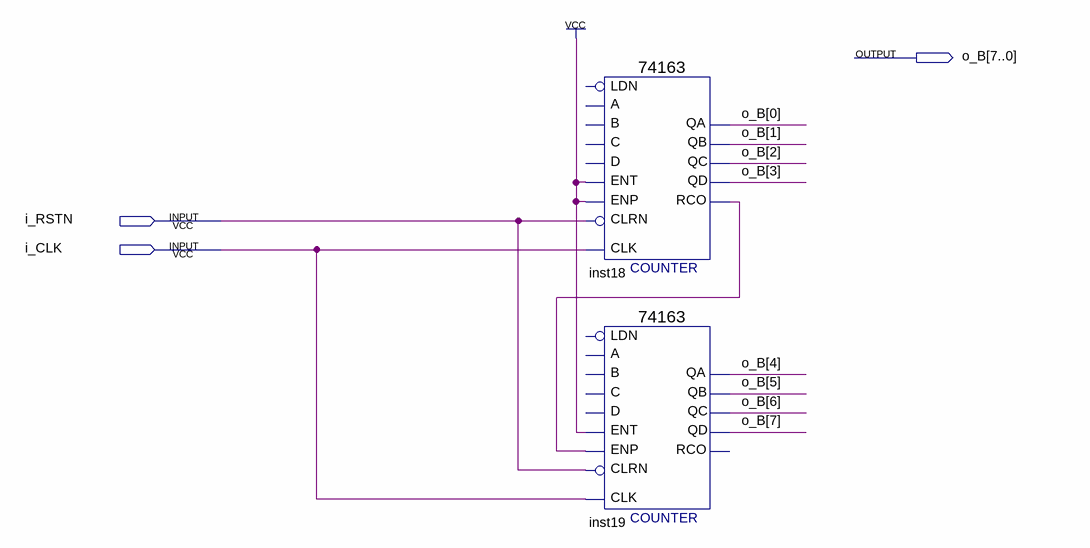
[diagram p0: schematic sheet]
// Quartus schematic counter_99.bdf as structural Verilog: 2 symbols, 3 pins
module counter_99 (
  input  i_RSTN,
  input  i_CLK,
  output [7:0] o_B
);

  wire inst18_rco;

  \74163  inst18 (
    .ENT(1'b1), .CLRN(i_RSTN), .CLK(i_CLK), .ENP(1'b1), .QA(o_B[0]), .QB(o_B[1]), .QC(o_B[2]), .QD(o_B[3]),
    .RCO(inst18_rco));  // open: C, B, A, D, LDN
  \74163  inst19 (
    .ENT(1'b1), .CLRN(i_RSTN), .CLK(i_CLK), .ENP(inst18_rco), .QA(o_B[4]), .QB(o_B[5]), .QC(o_B[6]),
    .QD(o_B[7]));  // open: C, B, A, D, LDN, RCO
endmodule
